# Altium project Z80 Card for Commodore C64.PrjPcb
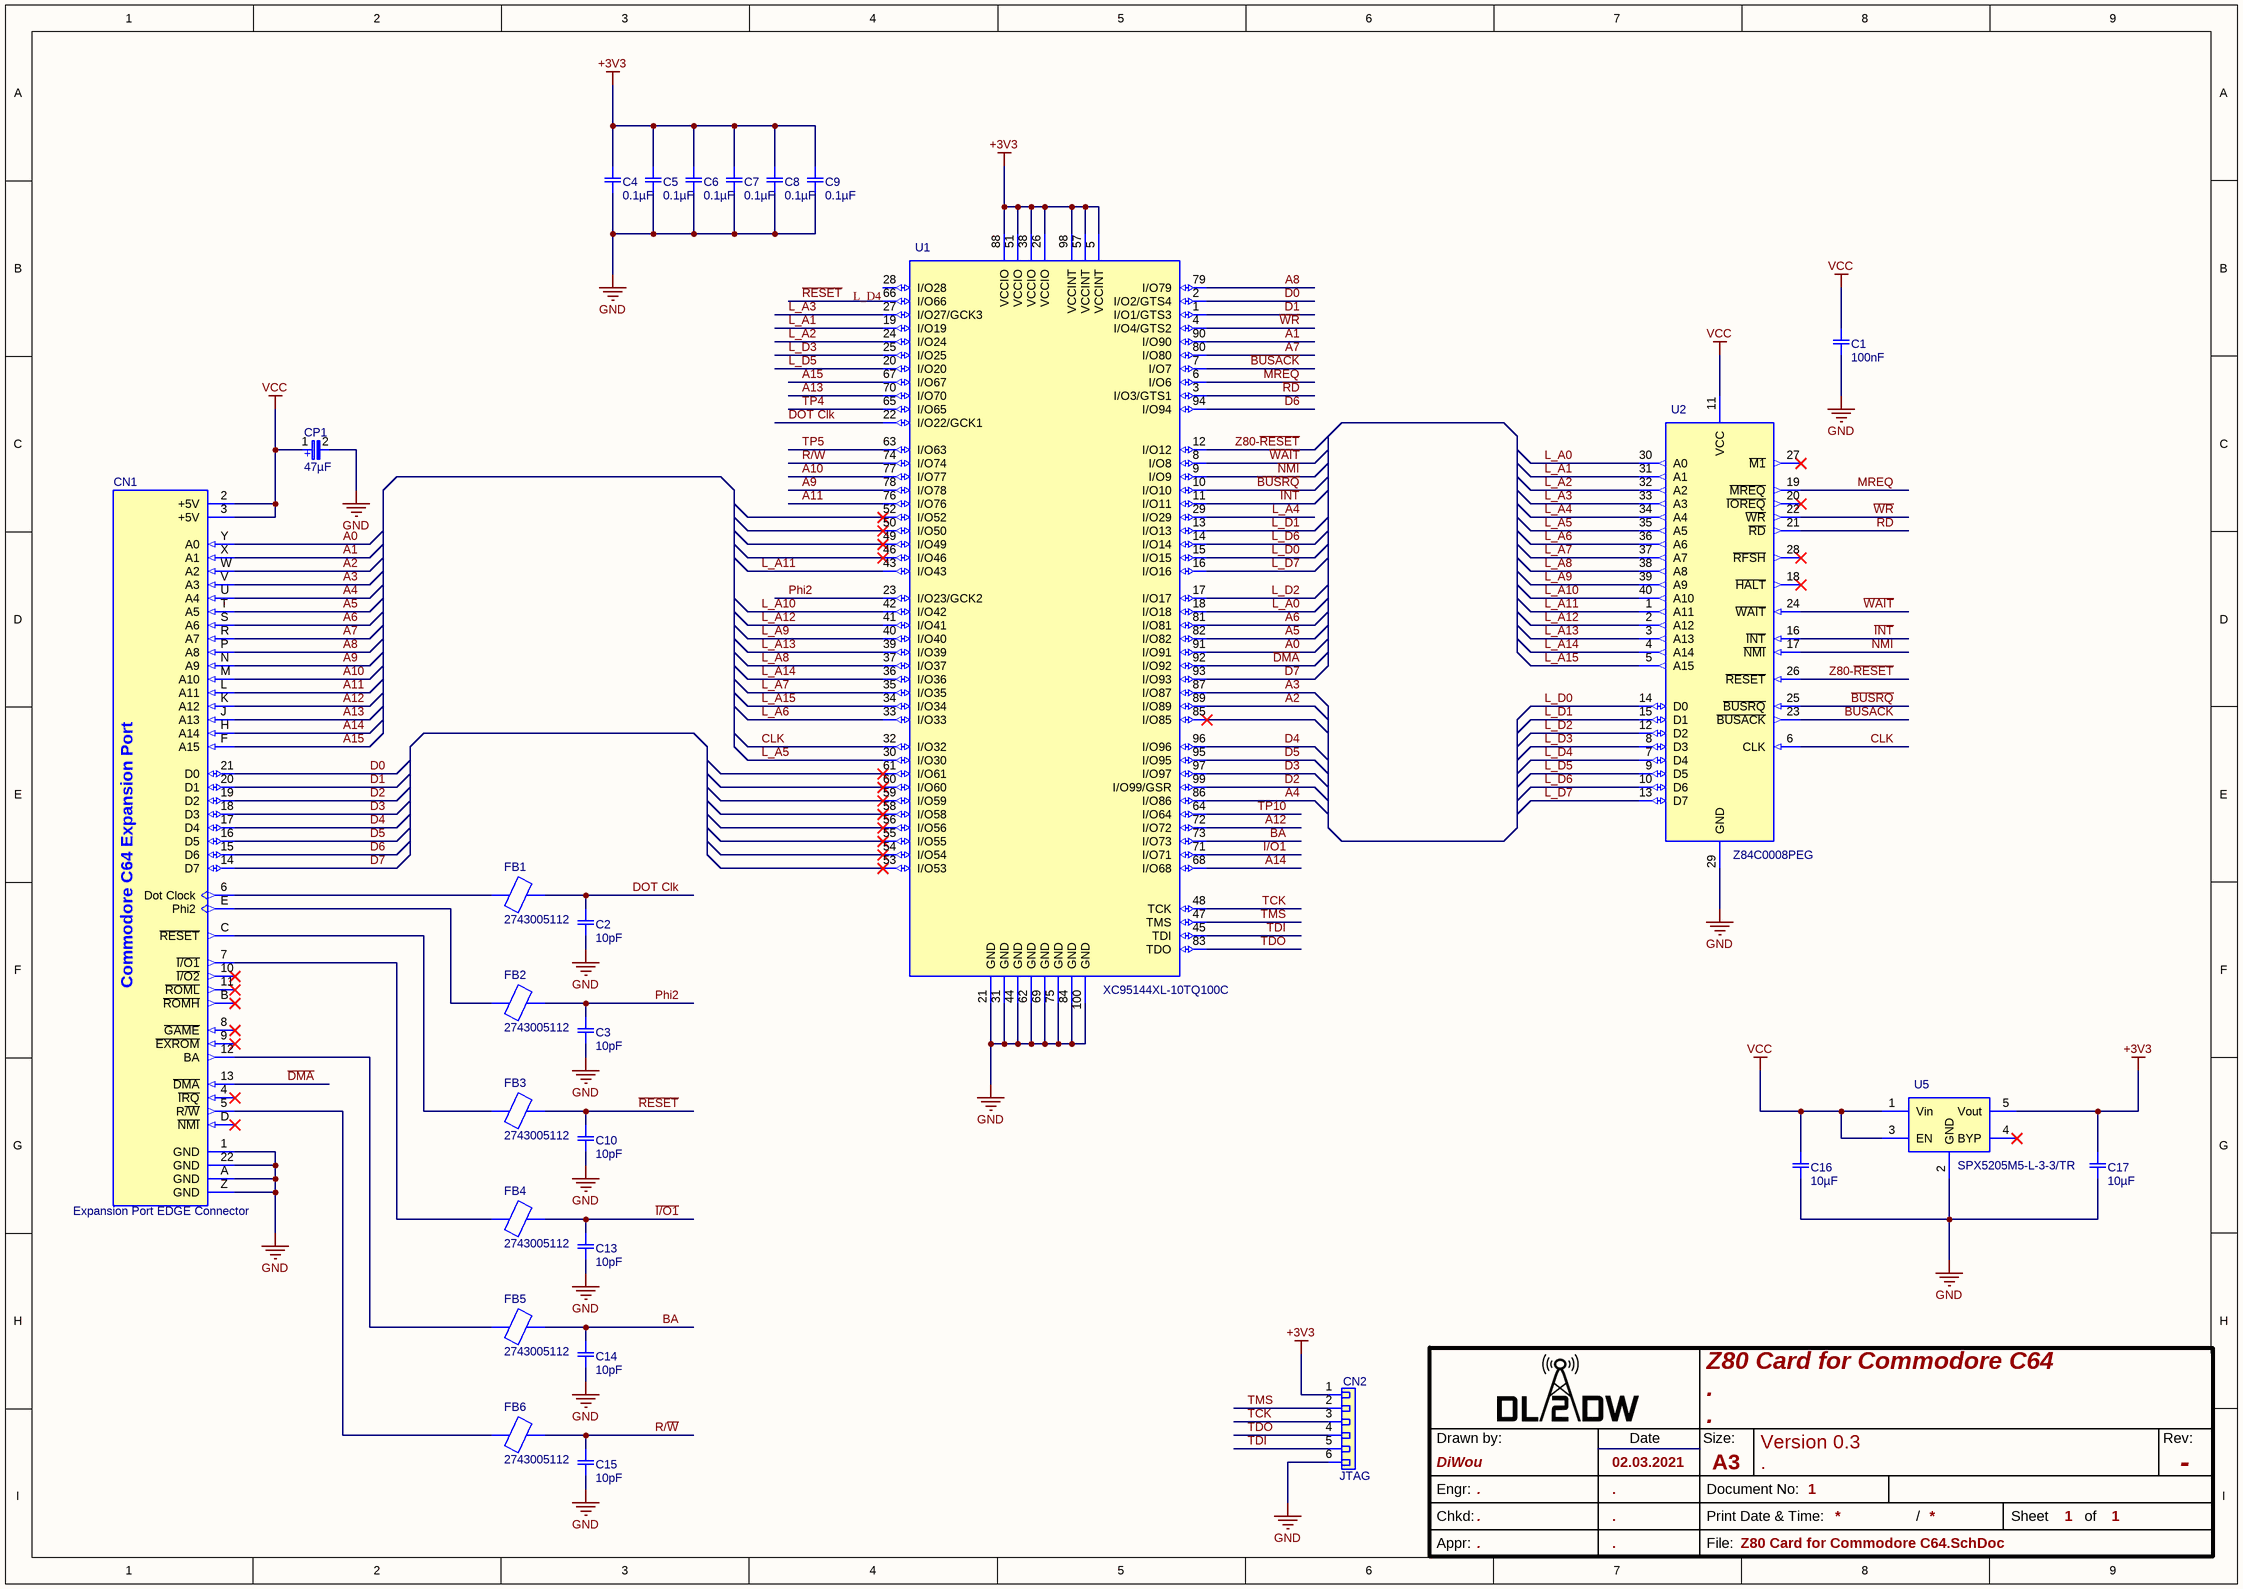
[diagram p0: Z80 Card for Commodore C64.SchDoc]
Author: PCB-Tech; Revision: -; Title: Projektname; Version: 0.3
1 sheet, 27 parts. Net scope: global (net labels, ports and power ports of the same name join across sheets).
Board file: Z80 Card for Commodore C64.PcbDoc

## Sheet Z80 Card for Commodore C64.SchDoc: Z80 Card for Commodore C64
size 420 x 297 mm; ApprovedBy: .; CheckedBy: .; Author: DiWou; CompanyName: DL2DW; DrawnBy: DiWou; Engineer: .; Organization: DL2DW; DocumentNumber: 1; Revision: -; SheetNumber: 1; SheetTotal: 1; DrawnDate: 02.03.2021; EngrDate: .; ChkdDate: .; Title1: Z80 Card for Commodore C64; Title2: .; Title3: .; Desc1: Version 0.3; Desc2: .; ApprDate: .

### Parts
C1  100nF  [CAP Disc 100nF P2.54mm D5.5mm T3mm]
C2  10pF  [CAP CER 10PF 25V C0G-NP0 RADIAL Kemet C315C100J3G5TA]
C3  10pF  [CAP CER 10PF 25V C0G-NP0 RADIAL Kemet C315C100J3G5TA]
C4  0.1µF  [CAP 100nF SMD 0603 C0603C104J3RACTU]
C5  0.1µF  [CAP 100nF SMD 0603 C0603C104J3RACTU]
C6  0.1µF  [CAP 100nF SMD 0603 C0603C104J3RACTU]
C7  0.1µF  [CAP 100nF SMD 0603 C0603C104J3RACTU]
C8  0.1µF  [CAP 100nF SMD 0603 C0603C104J3RACTU]
C9  0.1µF  [CAP 100nF SMD 0603 C0603C104J3RACTU]
C10  10pF  [CAP CER 10PF 25V C0G-NP0 RADIAL Kemet C315C100J3G5TA]
C13  10pF  [CAP CER 10PF 25V C0G-NP0 RADIAL Kemet C315C100J3G5TA]
C14  10pF  [CAP CER 10PF 25V C0G-NP0 RADIAL Kemet C315C100J3G5TA]
C15  10pF  [CAP CER 10PF 25V C0G-NP0 RADIAL Kemet C315C100J3G5TA]
C16  10µF  [Kemet C0805CxxxK8RACTU Series H=1.4mm]
C17  10µF  [Kemet C0805CxxxK8RACTU Series H=1.4mm]
CN1  Expansion Port EDGE Connector  [C64 Expansion Port EDGE Connector]  (no BOM)
CN2  JTAG  [Pin Header 01x06 2.54mm Horizontal Male]
CP1  47µF  [CAP 47µF16V D6mm H6.3mm P2.5mm]
FB1  2743005112  [Ferrite Bead Fair Rite 2743005112]
FB2  2743005112  [Ferrite Bead Fair Rite 2743005112]
FB3  2743005112  [Ferrite Bead Fair Rite 2743005112]
FB4  2743005112  [Ferrite Bead Fair Rite 2743005112]
FB5  2743005112  [Ferrite Bead Fair Rite 2743005112]
FB6  2743005112  [Ferrite Bead Fair Rite 2743005112]
U1  XC95144XL-10TQ100C  [TQFP-100 P0.5mm XC95144XL-7TQ100C]
U2  Z84C0008PEG  [Zilog Z80 CPU with Socket]
U5  SPX5205M5-L-3-3/TR  [SOT-23-5]

### Nets
+3V3: C4.2 C5.2 C6.2 C7.2 C8.2 C9.2 C17.2 CN2.1 U1.5(VCCINT) U1.26(VCCIO) U1.38(VCCIO) U1.51(VCCIO) U1.57(VCCINT) U1.88(VCCIO) U1.98(VCCINT) U5.5(Vout)
GND: C1.1 C2.1 C3.1 C4.1 C5.1 C6.1 C7.1 C8.1 C9.1 C10.1 C13.1 C14.1 C15.1 C16.1 C17.1 CN1.1(GND) CN1.22(GND) CN1.A(GND) CN1.Z(GND) CN2.6 CP1.2 U1.21(GND) U1.31(GND) U1.44(GND) U1.62(GND) U1.69(GND) U1.75(GND) U1.84(GND) U1.100(GND) U2.29(GND) U5.2(GND)
VCC: C1.2 C16.2 CN1.2(+5V) CN1.3(+5V) CP1.1 U2.11(VCC) U5.1(Vin) U5.3(EN)
A0: CN1.Y(A0) U1.91(I/O91)
A1: CN1.X(A1) U1.90(I/O90)
A2: CN1.W(A2) U1.89(I/O89)
A3: CN1.V(A3) U1.87(I/O87)
A4: CN1.U(A4) U1.86(I/O86)
A5: CN1.T(A5) U1.82(I/O82)
A6: CN1.S(A6) U1.81(I/O81)
A7: CN1.R(A7) U1.80(I/O80)
A8: CN1.P(A8) U1.79(I/O79)
A9: CN1.N(A9) U1.78(I/O78)
A10: CN1.M(A10) U1.77(I/O77)
A11: CN1.L(A11) U1.76(I/O76)
A12: CN1.K(A12) U1.72(I/O72)
A13: CN1.J(A13) U1.70(I/O70)
A14: CN1.H(A14) U1.68(I/O68)
A15: CN1.F(A15) U1.67(I/O67)
~{BUSACK}: U1.7(I/O7) U2.23(~{BUSACK})
~{BUSRQ}: U1.10(I/O10) U2.25(~{BUSRQ})
BA: C14.2 FB5.2 U1.73(I/O73)
CLK: U1.32(I/O32) U2.6(CLK)
D0: CN1.21(D0) U1.2(I/O2/GTS4)
D1: CN1.20(D1) U1.1(I/O1/GTS3)
D2: CN1.19(D2) U1.99(I/O99/GSR)
D3: CN1.18(D3) U1.97(I/O97)
D4: CN1.17(D4) U1.96(I/O96)
D5: CN1.16(D5) U1.95(I/O95)
D6: CN1.15(D6) U1.94(I/O94)
D7: CN1.14(D7) U1.93(I/O93)
~{DMA}: CN1.13(~{DMA}) U1.92(I/O92)
DOT Clk: C2.2 FB1.2 U1.22(I/O22/GCK1)
~{I/O1}: C13.2 FB4.2 U1.71(I/O71)
~{INT}: U1.11(I/O11) U2.16(~{INT})
L_A0: U1.18(I/O18) U2.30(A0)
L_A1: U1.19(I/O19) U2.31(A1)
L_A2: U1.24(I/O24) U2.32(A2)
L_A3: U1.27(I/O27/GCK3) U2.33(A3)
L_A4: U1.29(I/O29) U2.34(A4)
L_A5: U1.30(I/O30) U2.35(A5)
L_A6: U1.33(I/O33) U2.36(A6)
L_A7: U1.35(I/O35) U2.37(A7)
L_A8: U1.37(I/O37) U2.38(A8)
L_A9: U1.40(I/O40) U2.39(A9)
L_A10: U1.42(I/O42) U2.40(A10)
L_A11: U1.43(I/O43) U2.1(A11)
L_A12: U1.41(I/O41) U2.2(A12)
L_A13: U1.39(I/O39) U2.3(A13)
L_A14: U1.36(I/O36) U2.4(A14)
L_A15: U1.34(I/O34) U2.5(A15)
L_D0: U1.15(I/O15) U2.14(D0)
L_D1: U1.13(I/O13) U2.15(D1)
L_D2: U1.17(I/O17) U2.12(D2)
L_D3: U1.25(I/O25) U2.8(D3)
L_D4: U1.28(I/O28) U2.7(D4)
L_D5: U1.20(I/O20) U2.9(D5)
L_D6: U1.14(I/O14) U2.10(D6)
L_D7: U1.16(I/O16) U2.13(D7)
MREQ: U1.6(I/O6) U2.19(~{MREQ})
~{NMI}: U1.9(I/O9) U2.17(~{NMI})
Phi2: C3.2 FB2.2 U1.23(I/O23/GCK2)
R/~{W}: C15.2 FB6.2 U1.74(I/O74)
~{RD}: U1.3(I/O3/GTS1) U2.21(~{RD})
~{RESET}: C10.2 FB3.2 U1.66(I/O66)
TCK: CN2.3 U1.48(TCK)
TDI: CN2.5 U1.45(TDI)
TDO: CN2.4 U1.83(TDO)
TMS: CN2.2 U1.47(TMS)
TP4: U1.65(I/O65)
TP5: U1.63(I/O63)
TP10: U1.64(I/O64)
~{WAIT}: U1.8(I/O8) U2.24(~{WAIT})
~{WR}: U1.4(I/O4/GTS2) U2.22(~{WR})
Z80-~{RESET}: U1.12(I/O12) U2.26(~{RESET})
NetCN1_5: CN1.5(R~{/W}) FB6.1
NetCN1_6: CN1.6(Dot_Clock) FB1.1
NetCN1_7: CN1.7(~{I/O1}) FB4.1
NetCN1_12: CN1.12(BA) FB5.1
NetCN1_C: CN1.C(~{RESET}) FB3.1
NetCN1_E: CN1.E(Phi2) FB2.1

Not connected (* = marked no-connect by the designer): CN1 4(~{IRQ})* 8(~{GAME})* 9(~{EXROM})* 10(~{I/O2})* 11(~{ROML})* B(~{ROMH})* D(~{NMI})*; U1 46(I/O46)* 49(I/O49)* 50(I/O50)* 52(I/O52)* 53(I/O53)* 54(I/O54)* 55(I/O55)* 56(I/O56)* 58(I/O58)* 59(I/O59)* 60(I/O60)* 61(I/O61)* 85(I/O85)*; U2 18(~{HALT})* 20(~{IOREQ})* 27(~{M1})* 28(~{RFSH})*; U5 4(BYP)*

### Notes on the sheet
- Drawn by:
- Date
- Size:
- A3
- Rev:
- Engr:
- Chkd:
- Appr:
- File:
- Document No:
- Print Date & Time:
- /
- Sheet
- of
- (in symbol CMP-Capacitors-Electrolyt_Capacitors00000-5) +
- (in symbol CMP-Commodore-00008-4) Commodore C64 Expansion Port

### Library data of the parts
C1 = CMP-Capacitors-Ceramic_Capacitors-00007-4: Ceramic Disc Capacitors 100nF -20%~+80% 50V Through Hole,P=2.54mm RoHS; ComponentLink1URL: https://lcsc.com/product-detail/Others_Dersonic-CC1H104ZA1PD3F5O3000_C353909.html
C2 C3 C10 C13-C15 = CMP-Capacitors-Ceramic_Capacitors-00049-1: CAP CER 10PF 25V C0G/NP0 RADIAL
C4-C9 = CMP-Capacitors-Ceramic_Capacitors-00012-1: KEMET         C0603C104J3RACTU             SMD Multilayer Ceramic Capacitor, 0603 [1608 Metric], 0.1 F, 25 V,  5%, X7R, C Series; Voltage Rating (DC): 25V; Capacitance: 100nF; Height: 0.8mm; Dielectric: X7R; Case Code (Metric): 1608; Width: 0.031inch; Depth: 0.8mm; Min Operating Temperature: -55°C; Number of Pins: 2; Mount: Surface Mount,PCB; REACH SVHC: No SVHC; Packaging: Tape and Reel; Case Code (Imperial): 0603; Contact Plating: Tin,Matte; Length: 1.6mm; Case/Package: 0603; Lead Pitch: 0.7mm; Package Quantity: 4000; Tolerance: 5%; Radiation Hardening: No; Dielectric Material: Ceramic; Voltage: 25V; Termination: SMD/SMT; Voltage Rating: 25V; Thickness: 0.034inch; Max Operating Temperature: 125°C
C16 C17 = CMP-Capacitors-Ceramic_Capacitors-00016-2: KEMET - C0805C106K8RACTU - CAP, 10µF, 10V, 10%, X7R, 0805; Dissipation Factor: 7.5%; Capacitance: 10uF; Max Operating Temperature: 125°C; Packaging: Tape and Reel; Case Code (Imperial): 0805; Depth: 1.25mm; Dielectric Material: Ceramic; Voltage: 10V; Voltage Rating (DC): 10V; Mount: Surface Mount,PCB; Min Operating Temperature: -55°C; Case Code (Metric): 2012; Case/Package: 0805; Thickness: 0.055inch; Termination: SMD/SMT; Voltage Rating: 10V; Height: 1.25mm; Dielectric: X7R; Width: 1.2mm; Package Quantity: 1; Length: 2mm; REACH SVHC: No SVHC; Tolerance: 10%
CN1 = CMP-Commodore-00008-4: Expansion Port EDGE Connector for Interface Cards
CN2 = CMP-Connectors-Male_PIN_Headers-00005-2: CONN HEADER VERT 6POS 2.54MM; Connector Type: Male Pin; Pitch: 0.1inch; Number of Positions: 6; Packaging: Bulk; Termination: Solder; Package Quantity: 1; Contact Mating Length: 0.318inch; Contact Plating: Gold; Color: Black; Mount: Through Hole; Number of Rows: 1
CP1 = CMP-Capacitors-Electrolyt_Capacitors00000-5: Aluminum Electrolytic Capacitors - Leaded 47uF 105c; Ripple Current: 115mA; Impedance: 1.3R; Life (Hours): 1000Hour; Voltage Rating: 16V; Tolerance: 20%; Height - Seated (Max): 0.236inch; Package Quantity: 2000; Lead Pitch: 0.098inch; Case/Package: Radial; Capacitance: 47uF; Max Operating Temperature: 105°C; Mount: Through Hole; Termination: Radial; Packaging: Tape and Reel; Min Operating Temperature: -55°C; Length: 5mm; Voltage Rating (DC): 16V
FB1-FB6 = CMP-Inductors-00000-10: Ferrite Beads Axial 91Ohm 100MHz T/R; Impedance: 91R; Shielding: Unshielded; Min Operating Temperature: -55°C; Test Frequency: 100MHz; Termination: Axial; Max Operating Temperature: 125°C; Package Quantity: 4500; Diameter: 3.5mm; Packaging: Tape and Reel; Case/Package: Axial; Length: 6mm
U1 = CMP-ICs-CPLD_FPGA-00000-1: IC CPLD 144MC 7.5NS 100TQFP; Speed Grade: 7; Operating Supply Voltage: 3.3V; Max Supply Voltage: 3.6V; Number of Gates: 3200; Min Supply Voltage: 3V; Number of I/Os: 81; Number of Macrocells: 144; Number of Logic Blocks (LABs): 8; Max Frequency: 125MHz; Memory Type: FLASH; Turn-On Delay Time: 7.5ns; Mount: Surface Mount; Number of Pins: 100; Propagation Delay: 7.5ns; Package Quantity: 90; Case/Package: LQFP; Contact Plating: Tin,Lead; Packaging: Tray; Lead Free: Contains Lead; Min Operating Temperature: 0°C; Number of Logic Elements/Cells: 8; Max Operating Temperature: 70°C
U2 = CMP-ICs-00009-1: IC MPU Z80 8MHZ 40DIP; Memory Size: 64KB; Core Architecture: Z8; Data Bus Width: 8b; Memory Type: ROMless; Max Supply Voltage: 5V; Number of I/Os: 24; Min Supply Voltage: 4.5V; Max Operating Temperature: 100°C; Mount: Through Hole; REACH SVHC: Unknown; Lead Free: Lead Free; Case/Package: DIP; Max Frequency: 8MHz; Frequency: 8MHz; Length: 62.74mm; Height: 4.19mm; Radiation Hardening: No; Packaging: Rail/Tube; Number of Pins: 40; Voltage: 5V; Min Operating Temperature: -40°C; Width: 14.22mm; Package Quantity: 10
U5 = CMP-ICs-Power_Supply-00002-2: LDO Regulator Pos 3.3V 0.15A 5-Pin SOT-23 T/R; Min Input Voltage: 2.5V; Number of Outputs: 1; Dropout Voltage: 210mV; Accuracy: 1%; Polarity: Positive; Max Input Voltage: 16V; Output Type: Fixed; Output Current: 150mA; Quiescent Current: 1uA; Packaging: Tape and Reel; Lead Free: Lead Free; Case/Package: SOT-23; Height: 1.15mm; Number of Regulators: 1; Max Operating Temperature: 125°C; Min Operating Temperature: -40°C; Output Voltage: 3.3V; Width: 1.6mm; Radiation Hardening: No; Mount: Surface Mount; Length: 2.9mm; Max Output Current: 150mA; Min Output Voltage: 3.3V; Number of Pins: 5